# Altium schematic sheet 3_bootleg-ev-mcu.SchDoc: =ProjectTitle
size A4; Address1: github.com/4pplet/bootlegs; Address2: Licence: CERN-OHL-S; Address4: www.4pplet.com; SheetNumber: 3; SheetTotal: 4
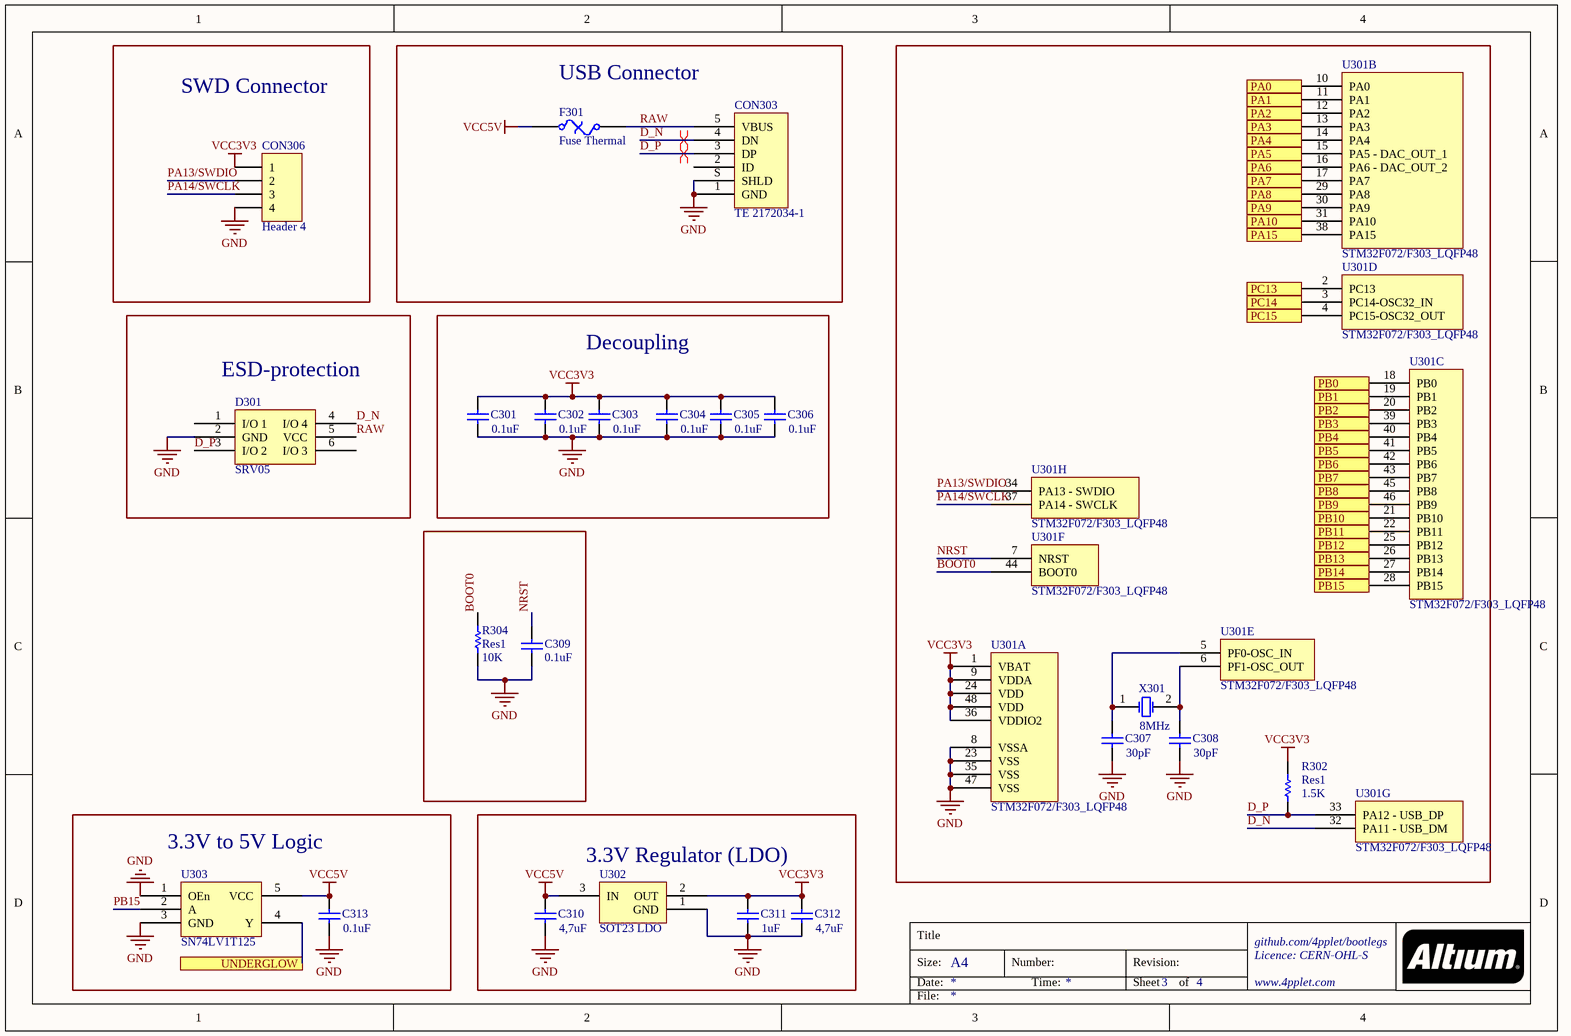
[diagram p0: 3_bootleg-ev-mcu.SchDoc]

## Parts
C301  value 0.1uF  [C0603[1608]]
C302  value 0.1uF  [C0603[1608]]
C303  value 0.1uF  [C0603[1608]]
C304  value 0.1uF  [C0603[1608]]
C305  value 0.1uF  [C0603[1608]]
C306  value 0.1uF  [C0603[1608]]
C307  value 30pF  [C0603[1608]]
C308  value 30pF  [C0603[1608]]
C309  value 0.1uF  [C0603[1608]]
C310  value 4,7uF  [C0603[1608]]
C311  value 1uF  [C0603[1608]]
C312  value 4,7uF  [C0603[1608]]
C313  value 0.1uF  [C0603[1608]]
CON303  TE 2172034-1  [TE 2172034-1]
CON306  Header 4  [HDR1X4]  (no BOM)
D301  SRV05  [SOT-23-6]
F301  Fuse Thermal  [C1206[3216]]
R302  Res1  value 1.5K  [R0603[1608]]
R304  Res1  value 10K  [R0603[1608]]
U301  STM32F072/F303_LQFP48  [STM32 - LQFP48, 7x7mm]  (parts A,B,C,D,E,F,G,H of 8)
U302  SOT23 LDO  [SOT-23-3]
U303  SN74LV1T125  [SOT-23-5]
X301  value 8MHz  [CTS 445-series crystal]  (hidden comment: XTAL)

## Blocks framed on the sheet
SWD Connector: CON306
USB Connector: CON303 F301
ESD-protection: D301
Decoupling: C301-C306
3.3V to 5V Logic: C313 U303
3.3V Regulator (LDO): C310-C312 U302

## Ports
PA0, PA1, PA2, PA3, PA4, PA5, PA6, PA7, PA8, PA9, PA10, PA15, PB0, PB1, PB2, PB3, PB4, PB5, PB6, PB7, PB8, PB9, PB10, PB11, PB12, PB13, PB14, PB15, PC13, PC14, PC15, UNDERGLOW

## Nets
GND: C301.1 C302.1 C303.1 C304.1 C305.1 C306.1 C307.1 C308.1 C309.2 C310.1 C311.1 C312.1 C313.1 CON303.1(GND) CON303.S(SHLD) CON306.4 D301.2(GND) R304.1 U301.8(VSSA) U301.23(VSS) U301.35(VSS) U301.47(VSS) U302.1(GND) U303.1(OEn) U303.3(GND)
VCC3V3: C301.2 C302.2 C303.2 C304.2 C305.2 C306.2 C311.2 C312.2 CON306.1 R302.1 U301.1(VBAT) U301.9(VDDA) U301.24(VDD) U301.36(VDDIO2) U301.48(VDD) U302.2(OUT)
VCC5V: C310.2 C313.2 F301.1 U302.3(IN) U303.5(VCC)
BOOT0: R304.2 U301.44(BOOT0)
D_N: CON303.4(DN) D301.4(I/O_4) U301.32(PA11_-_USB_DM)
D_P: CON303.3(DP) D301.3(I/O_2) R302.2 U301.33(PA12_-_USB_DP)
NRST: C309.1 U301.7(NRST)
PA0: U301.10(PA0) ; port PA0
PA1: U301.11(PA1) ; port PA1
PA2: U301.12(PA2) ; port PA2
PA3: U301.13(PA3) ; port PA3
PA4: U301.14(PA4) ; port PA4
PA5: U301.15(PA5_-_DAC_OUT_1) ; port PA5
PA6: U301.16(PA6_-_DAC_OUT_2) ; port PA6
PA7: U301.17(PA7) ; port PA7
PA8: U301.29(PA8) ; port PA8
PA9: U301.30(PA9) ; port PA9
PA10: U301.31(PA10) ; port PA10
PA13/SWDIO: CON306.2 U301.34(PA13_-_SWDIO)
PA14/SWCLK: CON306.3 U301.37(PA14_-_SWCLK)
PA15: U301.38(PA15) ; port PA15
PB0: U301.18(PB0) ; port PB0
PB1: U301.19(PB1) ; port PB1
PB2: U301.20(PB2) ; port PB2
PB3: U301.39(PB3) ; port PB3
PB4: U301.40(PB4) ; port PB4
PB5: U301.41(PB5) ; port PB5
PB6: U301.42(PB6) ; port PB6
PB7: U301.43(PB7) ; port PB7
PB8: U301.45(PB8) ; port PB8
PB9: U301.46(PB9) ; port PB9
PB10: U301.21(PB10) ; port PB10
PB11: U301.22(PB11) ; port PB11
PB12: U301.25(PB12) ; port PB12
PB13: U301.26(PB13) ; port PB13
PB14: U301.27(PB14) ; port PB14
PB15: U303.2(A)
PB15: U301.28(PB15) ; port PB15  [a separate net that carries the same name]
PC13: U301.2(PC13) ; port PC13
PC14: U301.3(PC14-OSC32_IN) ; port PC14
PC15: U301.4(PC15-OSC32_OUT) ; port PC15
RAW: CON303.5(VBUS) D301.5(VCC) F301.2
UNDERGLOW: U303.4(Y) ; port UNDERGLOW
NetC307_2: C307.2 U301.5(PF0-OSC_IN) X301.1(OSC1)
NetC308_2: C308.2 U301.6(PF1-OSC_OUT) X301.2(OSC2)

Not connected (* = marked no-connect by the designer): CON303 2(ID); D301 1(I/O_1) 6(I/O_3)

## Layout directives
differential pair: D_N, D_P

## Notes on the sheet
- Title
- Size:
- Date:
- A4
- Number:
- Time:
- Revision:
- Sheet
- of
- File:

## Library data of the parts
C301-C306 C309 C313 = Cap: Capacitor; MRF.Part: CC0603KRX7R9BB104; MFG: KEMET; MFGPN: C0603C104M5RACTU; LCSC MFG: YAGEO; Version: 0603 imperial; LCSC Part #: C14663
C307 C308 = Cap: Capacitor; MRF.Part: CL10C300JB8NNNC; LCSC MFG: Samsung Electro-Mechanics; Version: 0603 imperial; LCSC Part #: C22397
C310 C312 = Cap: Capacitor; LCSC MFG: Samsung Electro-Mechanics; LCSC Part #: C19666
C311 = Cap: Capacitor; MRF.Part: CL10A105KB8NNNC; MFG: KEMET; MFGPN: C0603C104M5RACTU; LCSC MFG: Samsung Electro-Mechanics; Version: 0603 imperial; LCSC Part #: C15849
CON306 = Header 4: Header, 4-Pin
D301 = SRV05: MRF.Part: SRV05-4-P-T7; LCSC MFG: ProTek Devices; LCSC Part #: C85364
F301 = Fuse Thermal: Thermal Fuse; MRF.Part: ASMD1206-050; MFG: Bel Fuse Inc.; MFGPN: 0ZCJ0050FF2G; LCSC MFG: Shenzhen JDT Fuse; LCSC Part #: C135338
R302 = Res1: Resistor; MRF.Part: 0603WAF1501T5E; LCSC MFG: Uniroyal Elec; Version: 0603 imperial; LCSC Part #: C22843
R304 = Res1: Resistor; MRF.Part: 0603WAF1002T5E; MFG: Panasonic Electronic Components; MFGPN: ERJ-3EKF5101V; LCSC MFG: Uniroyal Elec; Version: 0603 imperial; LCSC Part #: C25804
U301 = STM32F072/F303_LQFP48: MFG: STMicroelectronics; MFGPN: STM32F072CBT6TR
U302 = SOT23 LDO: MRF.Part: XC6206P332MR; LCSC MFG: Torex Semicon; MFG: Texas Instruments; MFGPN: TPS7A0533PDBZ; LCSC Part #: C5446
U303 = SN74LV1T125: SN74LV1T125 or SN74LV1T34. Connect OE to GND; MRF.Part: SN74LV1T125DBVR; LCSC MFG: Texas Instruments; LCSC Part #: C473338; Version: SOT-23
X301 = XTAL: Crystal Oscillator; MRF.Part: X50328MSB2GI; LCSC MFG: Yangxing Tech; Version: SMD-5032_2P; LCSC Part #: C115962